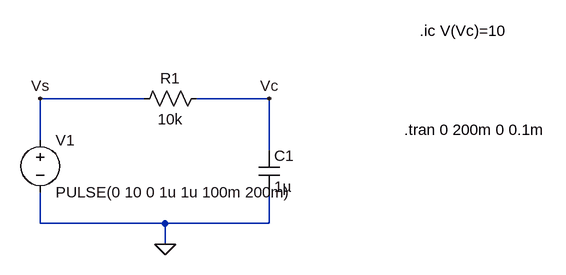
[diagram p0: schematic Circuit #4.asc]
Circuit #4.asc, the LTspice schematic file:
Version 4
SHEET 1 896 680
WIRE 256 80 96 80
WIRE 448 80 336 80
WIRE 96 144 96 80
WIRE 448 160 448 80
WIRE 96 272 96 224
WIRE 288 272 96 272
WIRE 448 272 448 224
WIRE 448 272 288 272
WIRE 288 304 288 272
FLAG 288 304 0
FLAG 96 80 Vs
FLAG 448 80 Vc
SYMBOL voltage 96 128 R0
WINDOW 123 0 0 Left 0
WINDOW 39 0 0 Left 0
SYMATTR InstName V1
SYMATTR Value PULSE(0 10 0 1u 1u 100m 200m)
SYMBOL res 352 64 R90
WINDOW 0 0 56 VBottom 2
WINDOW 3 32 56 VTop 2
SYMATTR InstName R1
SYMATTR Value 10k
SYMBOL cap 432 160 R0
SYMATTR InstName C1
SYMATTR Value 1µ
TEXT 656 128 Left 2 !.tran 0 200m 0 0.1m
TEXT 680 -24 Left 2 !.ic V(Vc)=10

The netlist it stands for:
* Circuit #4.asc
V1 Vs 0 PULSE(0 10 0 1u 1u 100m 200m)
R1 Vc Vs 10k
C1 Vc 0 1µ
.tran 0 200m 0 0.1m
.ic V(Vc)=10
.backanno
.end